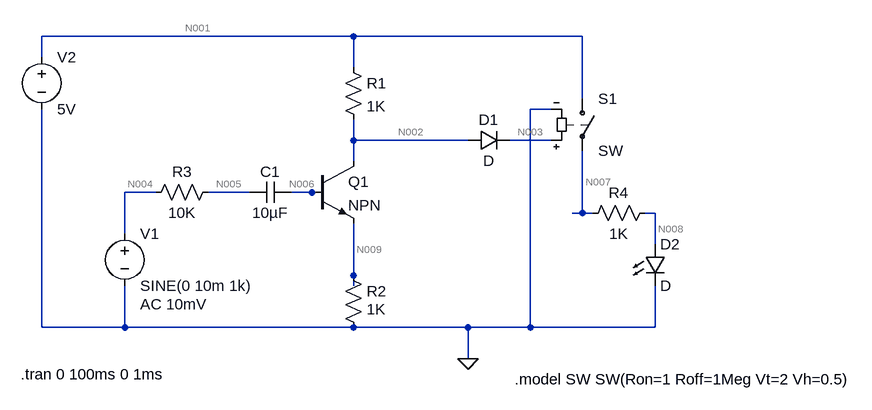
[diagram p0: schematic AC_micro.asc]
AC_micro.asc, the LTspice schematic file:
Version 4.1
SHEET 1 1020 680
WIRE 208 -80 -272 -80
WIRE 560 -80 208 -80
WIRE -272 -48 -272 -80
WIRE 208 -32 208 -80
WIRE 560 16 560 -80
WIRE 512 32 480 32
WIRE 208 80 208 48
WIRE 384 80 208 80
WIRE 512 80 448 80
WIRE 208 112 208 80
WIRE -96 160 -144 160
WIRE 48 160 -16 160
WIRE 144 160 112 160
WIRE 160 160 144 160
WIRE 560 192 560 96
WIRE 560 192 544 192
WIRE 576 192 560 192
WIRE 672 192 656 192
WIRE -144 224 -144 160
WIRE 672 240 672 192
WIRE 208 288 208 208
WIRE 208 304 208 288
WIRE -272 368 -272 32
WIRE -144 368 -144 304
WIRE -144 368 -272 368
WIRE 208 368 -144 368
WIRE 384 368 208 368
WIRE 480 368 480 32
WIRE 480 368 384 368
WIRE 672 368 672 304
WIRE 672 368 480 368
WIRE 384 416 384 368
FLAG 384 416 0
SYMBOL npn 144 112 R0
SYMATTR InstName Q1
SYMBOL cap 112 144 R90
WINDOW 0 0 32 VBottom 2
WINDOW 3 32 32 VTop 2
SYMATTR InstName C1
SYMATTR Value 10µF
SYMBOL res 192 -48 R0
SYMATTR InstName R1
SYMATTR Value 1K
SYMBOL res 192 272 R0
WINDOW 3 36 68 Left 2
SYMATTR Value 1K
SYMATTR InstName R2
SYMBOL res 0 144 R90
WINDOW 0 0 56 VBottom 2
WINDOW 3 32 56 VTop 2
SYMATTR InstName R3
SYMATTR Value 10K
SYMBOL diode 384 96 R270
WINDOW 0 32 32 VTop 2
WINDOW 3 0 32 VBottom 2
SYMATTR InstName D1
SYMBOL sw 560 0 R0
SYMATTR InstName S1
SYMBOL res 672 176 R90
WINDOW 0 0 56 VBottom 2
WINDOW 3 32 56 VTop 2
SYMATTR InstName R4
SYMATTR Value 1K
SYMBOL LED 656 240 R0
SYMATTR InstName D2
SYMBOL voltage -144 208 R0
WINDOW 123 24 124 Left 2
WINDOW 39 0 0 Left 0
SYMATTR Value2 AC 10mV
SYMATTR InstName V1
SYMATTR Value SINE(0 10m 1k)
SYMBOL voltage -272 -64 R0
WINDOW 123 0 0 Left 0
WINDOW 39 0 0 Left 0
SYMATTR InstName V2
SYMATTR Value 5V
TEXT -304 440 Left 2 !.tran 0 100ms 0 1ms
TEXT 456 448 Left 2 !.model SW SW(Ron=1 Roff=1Meg Vt=2 Vh=0.5)

The netlist it stands for:
* AC_micro.asc
Q1 N002 N006 N009 0 NPN
C1 N006 N005 10µF
R1 N001 N002 1K
R2 N009 0 1K
R3 N005 N004 10K
D1 N002 N003 D
S1 N001 N007 N003 0 SW
R4 N008 N007 1K
D2 N008 0 D
V1 N004 0 SINE(0 10m 1k) AC 10mV
V2 N001 0 5V
.model D D
.lib standard.dio
.model NPN NPN
.model PNP PNP
.lib standard.bjt
.tran 0 100ms 0 1ms
.model SW SW(Ron=1 Roff=1Meg Vt=2 Vh=0.5)
.backanno
.end

* Results of the author's LTspice run, read from the files saved beside the schematic
* Operating Point, zero values left out:
*   V(n006) = 394.5 mV
*   V(n001) = 5 V
*   V(n003) = 5 V
*   V(n002) = 5 V
*   V(n009) = 425.7 nV
*   V(n007) = 4.996 V
*   V(n008) = 693.1 mV
*   Ic(Q1) = 425.7 pA
*   Ie(Q1) = -425.7 pA
*   I(R4) = -4.303 mA
*   I(R1) = 425.7 pA
*   I(V2) = -4.303 mA
*   I(R2) = 425.7 pA
*   I(S1) = -4.303 mA
*   I(D2) = 4.334 mA
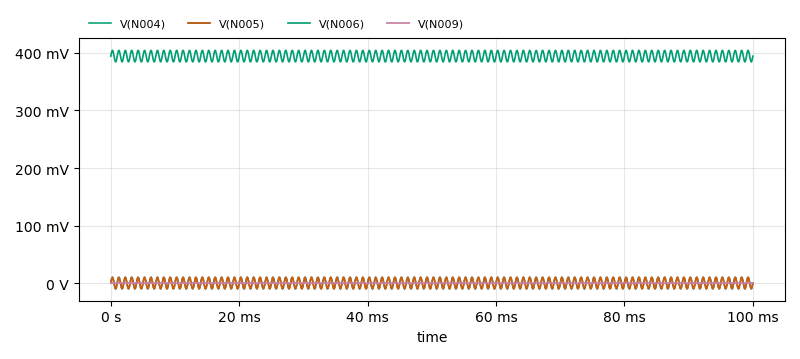
[diagram p1: Transient Analysis of AC_micro.asc, plotted from the saved traces]
* Transient Analysis, 1 run:
*   V(N004): min -10 mV, max 10 mV, average 131.5 nV, rms 7.193 mV, last 0 V
*   V(N005): min -10 mV, max 10 mV, average 130 nV, rms 7.193 mV, last 0 V
*   V(N006): min 384.5 mV, max 404.5 mV, average 394.5 mV, rms 394.6 mV, last 394.5 mV
*   V(N009): min 289.1 nV, max 626.2 nV, average 441.8 nV, rms 458.1 nV, last 425.6 nV